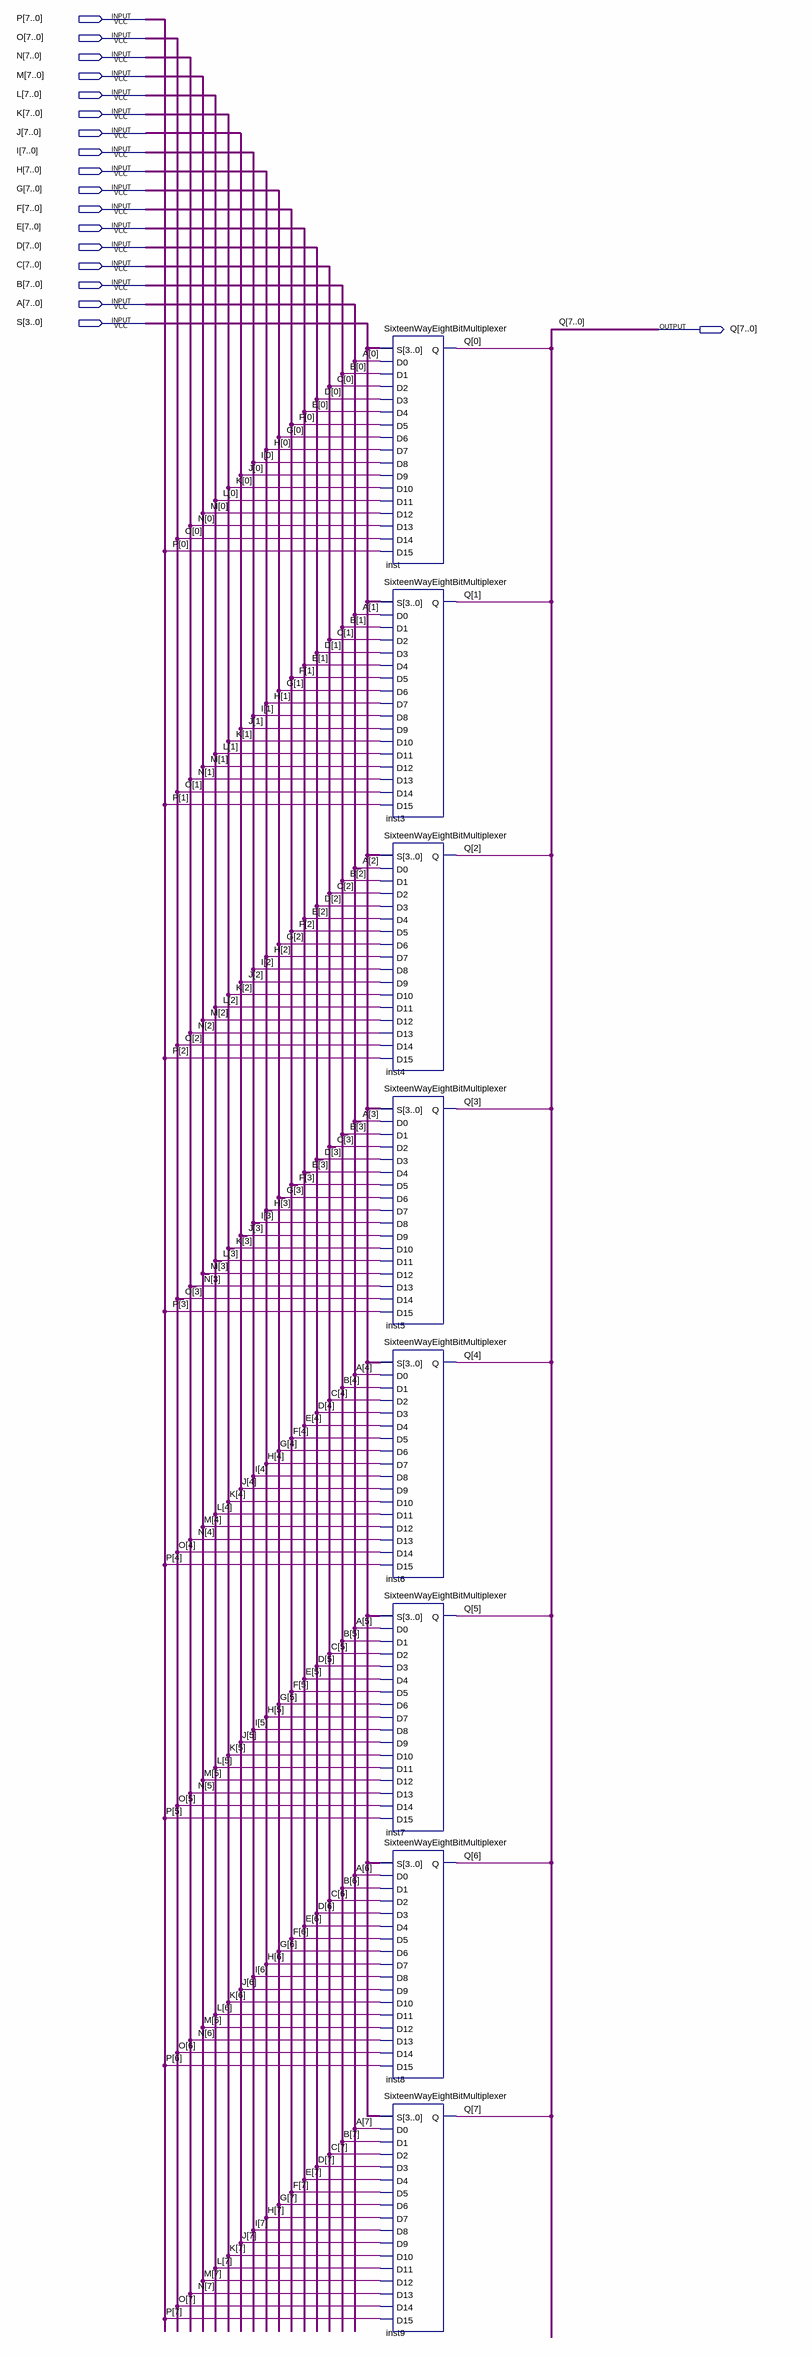
[diagram p0: schematic sheet]
// Quartus schematic SixteenWay8BitMUX.bdf as structural Verilog: 8 symbols, 18 pins
module SixteenWay8BitMUX (
  input  [7:0] P,
  input  [7:0] O,
  input  [7:0] N,
  input  [7:0] M,
  input  [7:0] L,
  input  [7:0] K,
  input  [7:0] J,
  input  [7:0] I,
  input  [7:0] H,
  input  [7:0] G,
  input  [7:0] F,
  input  [7:0] E,
  input  [7:0] D,
  input  [7:0] C,
  input  [7:0] B,
  input  [7:0] A,
  input  [3:0] S,
  output [7:0] Q
);

  SixteenWayEightBitMultiplexer inst (
    .S(S), .D0(A[0]), .D1(B[0]), .D2(C[0]), .D3(D[0]), .D4(E[0]), .D5(F[0]), .D6(G[0]), .D7(H[0]), .D8(I[0]),
    .D9(J[0]), .D10(K[0]), .D11(L[0]), .D12(M[0]), .D13(N[0]), .D14(O[0]), .D15(P[0]), .Q(Q[0]));
  SixteenWayEightBitMultiplexer inst3 (
    .S(S), .D0(A[1]), .D1(B[1]), .D2(C[1]), .D3(D[1]), .D4(E[1]), .D5(F[1]), .D6(G[1]), .D7(H[1]), .D8(I[1]),
    .D9(J[1]), .D10(K[1]), .D11(L[1]), .D12(M[1]), .D13(N[1]), .D14(O[1]), .D15(P[1]), .Q(Q[1]));
  SixteenWayEightBitMultiplexer inst4 (
    .S(S), .D0(A[2]), .D1(B[2]), .D2(C[2]), .D3(D[2]), .D4(E[2]), .D5(F[2]), .D6(G[2]), .D7(H[2]), .D8(I[2]),
    .D9(J[2]), .D10(K[2]), .D11(L[2]), .D12(M[2]), .D13(N[2]), .D14(O[2]), .D15(P[2]), .Q(Q[2]));
  SixteenWayEightBitMultiplexer inst5 (
    .S(S), .D0(A[3]), .D1(B[3]), .D2(C[3]), .D3(D[3]), .D4(E[3]), .D5(F[3]), .D6(G[3]), .D7(H[3]), .D8(I[3]),
    .D9(J[3]), .D10(K[3]), .D11(L[3]), .D12(M[3]), .D13(N[3]), .D14(O[3]), .D15(P[3]), .Q(Q[3]));
  SixteenWayEightBitMultiplexer inst6 (
    .S(S), .D0(A[4]), .D1(B[4]), .D2(C[4]), .D3(D[4]), .D4(E[4]), .D5(F[4]), .D6(G[4]), .D7(H[4]), .D8(I[4]),
    .D9(J[4]), .D10(K[4]), .D11(L[4]), .D12(M[4]), .D13(N[4]), .D14(O[4]), .D15(P[4]), .Q(Q[4]));
  SixteenWayEightBitMultiplexer inst7 (
    .S(S), .D0(A[5]), .D1(B[5]), .D2(C[5]), .D3(D[5]), .D4(E[5]), .D5(F[5]), .D6(G[5]), .D7(H[5]), .D8(I[5]),
    .D9(J[5]), .D10(K[5]), .D11(L[5]), .D12(M[5]), .D13(N[5]), .D14(O[5]), .D15(P[5]), .Q(Q[5]));
  SixteenWayEightBitMultiplexer inst8 (
    .S(S), .D0(A[6]), .D1(B[6]), .D2(C[6]), .D3(D[6]), .D4(E[6]), .D5(F[6]), .D6(G[6]), .D7(H[6]), .D8(I[6]),
    .D9(J[6]), .D10(K[6]), .D11(L[6]), .D12(M[6]), .D13(N[6]), .D14(O[6]), .D15(P[6]), .Q(Q[6]));
  SixteenWayEightBitMultiplexer inst9 (
    .S(S), .D0(A[7]), .D1(B[7]), .D2(C[7]), .D3(D[7]), .D4(E[7]), .D5(F[7]), .D6(G[7]), .D7(H[7]), .D8(I[7]),
    .D9(J[7]), .D10(K[7]), .D11(L[7]), .D12(M[7]), .D13(N[7]), .D14(O[7]), .D15(P[7]), .Q(Q[7]));
endmodule
